# Altium schematic sheet smoothieboard-5driver_3.SchDoc
size 409 x 279 mm; Date: 9/15/2017 15:08:36; Organization: Altium Limited; Address1: L3, 12a Rodborough Rd; Address2: Frenchs Forest; Address3: NSW; Address4: Australia 2086; Origin: Eagle
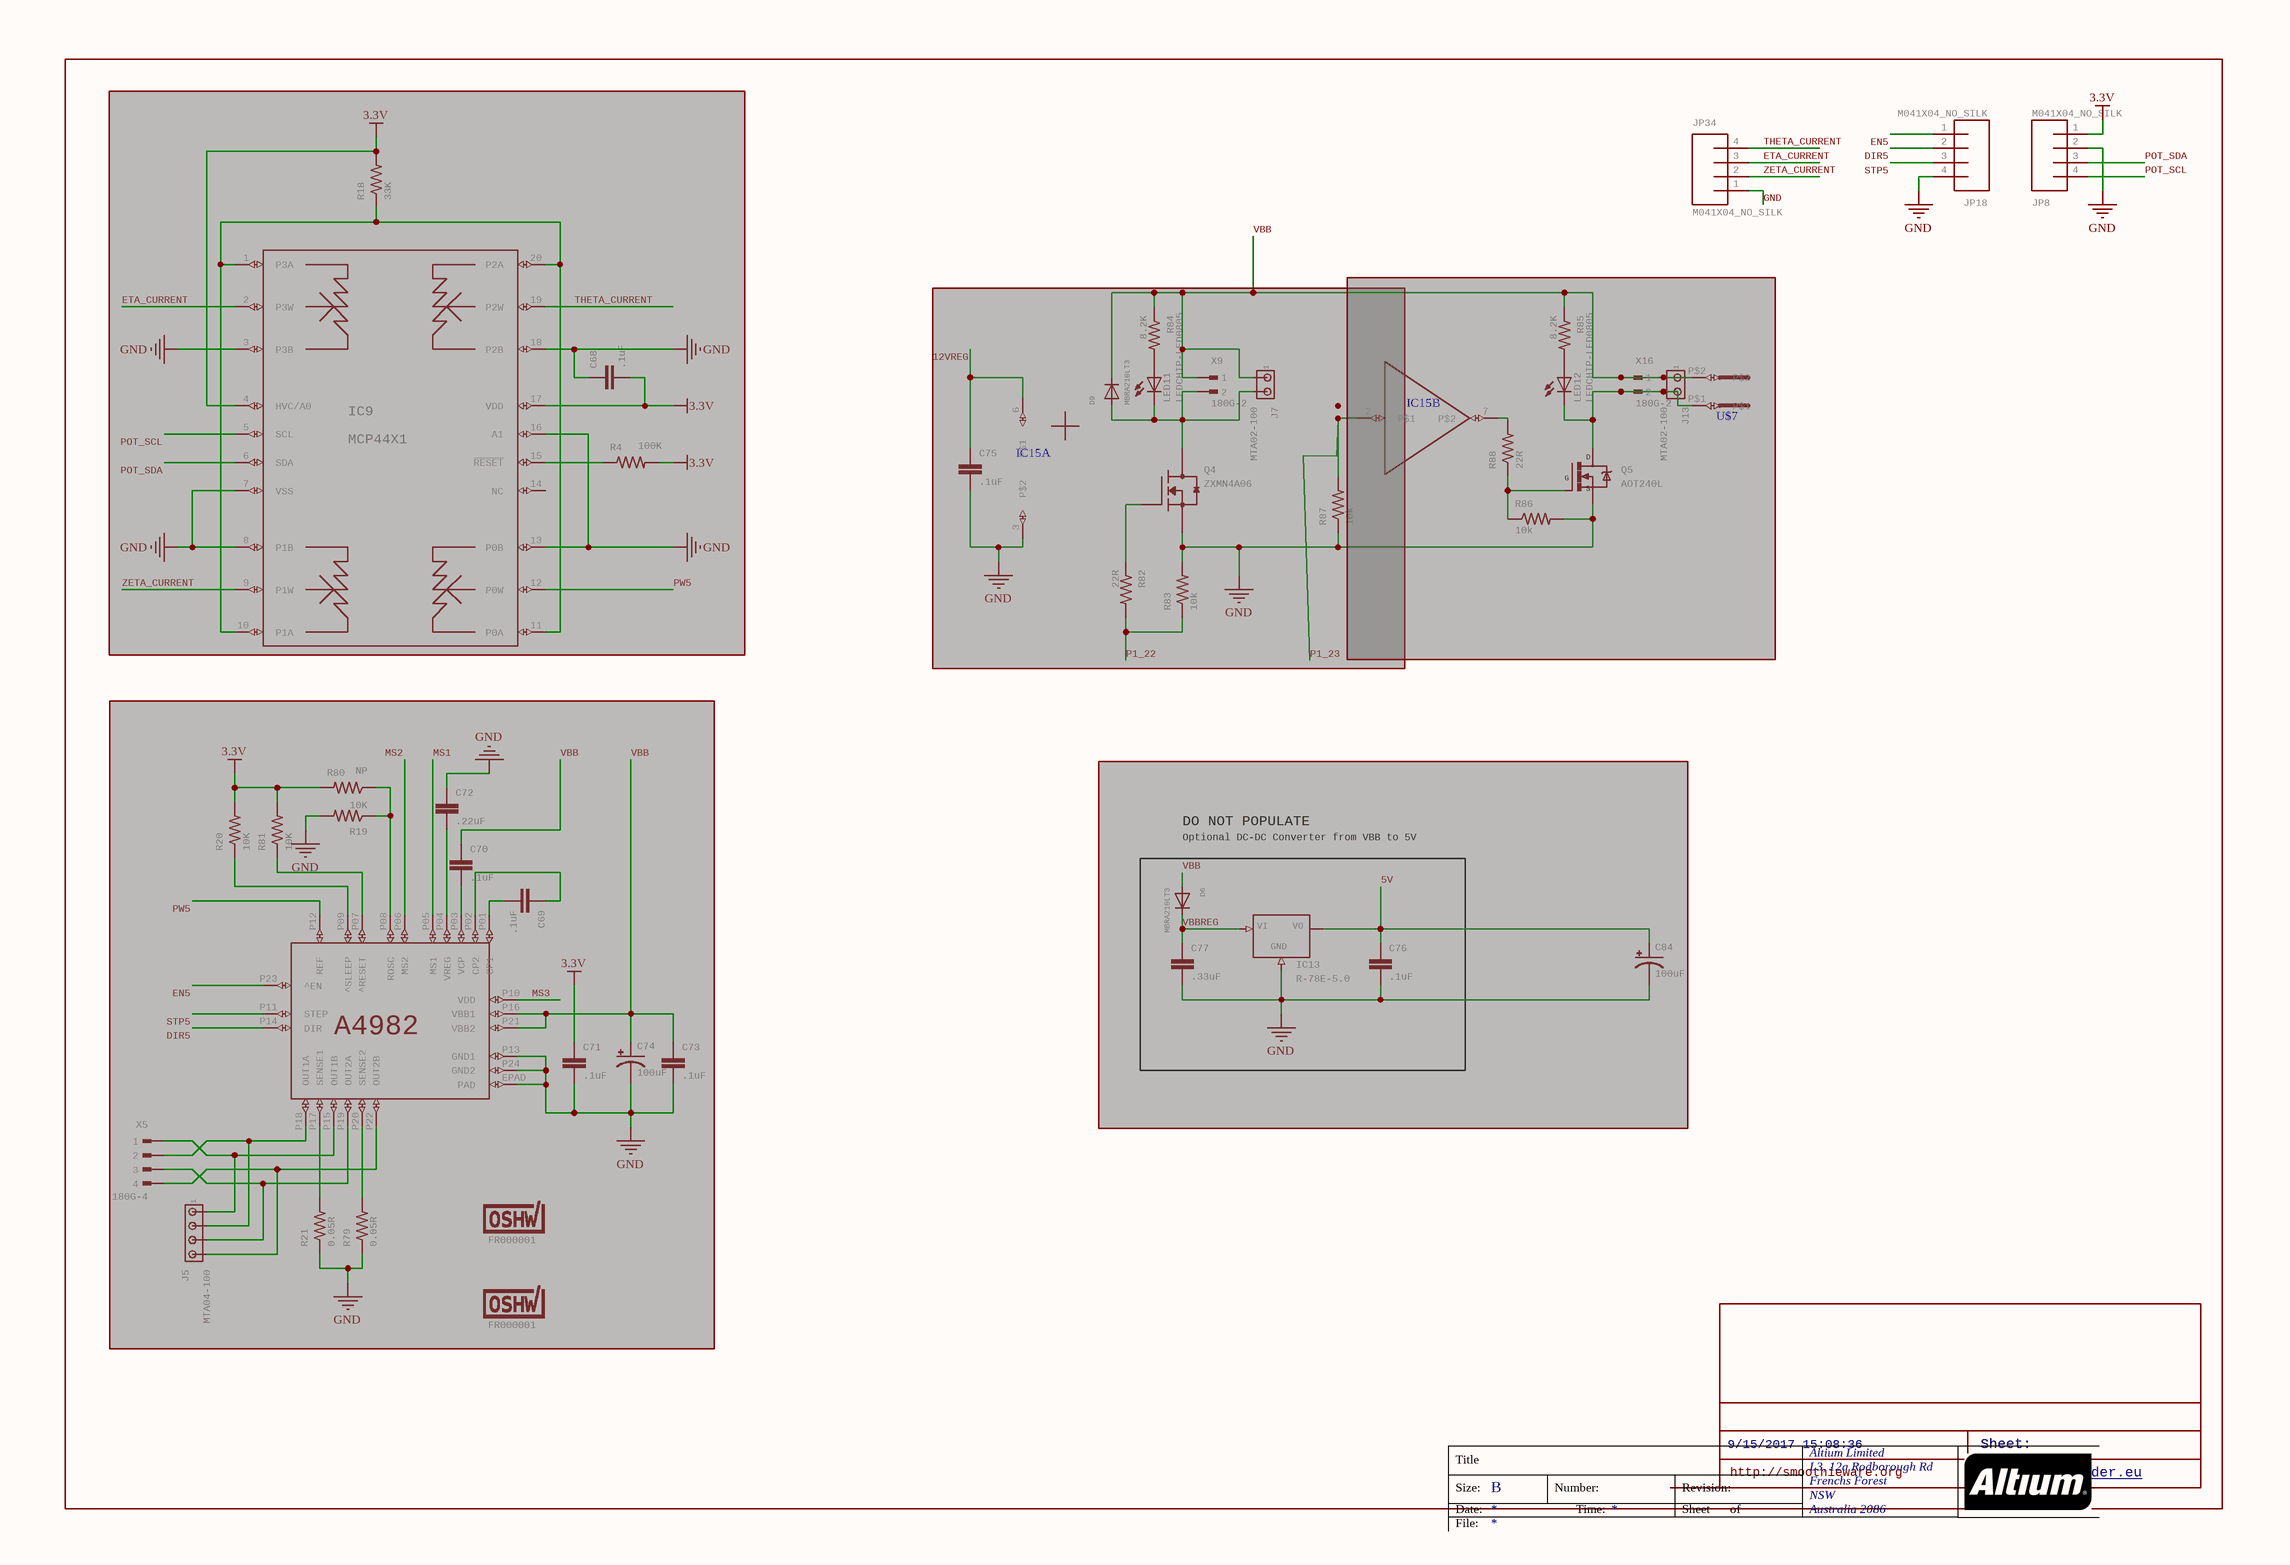
[diagram p0: smoothieboard-5driver_3.SchDoc]

## Parts
C68  .1uF  [C0603]
C69  .1uF  [C0603]
C70  .1uF  [C0603]
C71  .1uF  [C0603]
C72  .22uF  [C0603]
C73  .1uF  [C0603]
C74  100uF  [PANASONIC_E]
C75  .1uF  [C0603]
C76  .1uF  [C0603]
C77  .33uF  [C0603]
C84  100uF  [PANASONIC_D]
D6  MBRA210LT3  [SMADIODE]
D9  MBRA210LT3  [SMADIODE]
IC9  MCP44X1  [TSSOP20]
IC12  A5984  [ETSSOP24]  (value not drawn)
IC13  R-78E-5.0  [R-78]
IC15  TC4427  [SOIC8]  (value not drawn)  (parts A,B of 3)
J5  MTA04-100  [10X04MTA]
J7  MTA02-100  [10X02MTA]
J13  MTA02-100  [10X02MTA]
JP8  M041X04_NO_SILK  [1X04_NO_SILK]
JP18  M041X04_NO_SILK  [1X04_NO_SILK]
JP34  M041X04_NO_SILK  [1X04_NO_SILK]
LED11  LEDCHIP-LED0805  [CHIP-LED0805]
LED12  LEDCHIP-LED0805  [CHIP-LED0805]
Q4  ZXMN4A06  [SOT230P700X160-4N]
Q5  AOT240L  [TO220BV]
R4  100K  [R0603]
R18  33K  [R0603]
R19  10K  [R0603]
R20  10K  [R0603]
R21  0.05R  [R2512]
R79  0.05R  [R2512]
R80  NP  [R0603]
R81  10K  [R0603]
R82  22R  [R0603]
R83  10k  [R0603]
R84  8.2K  [R0603]
R85  8.2K  [R0603]
R86  10k  [R0603]
R87  10k  [R0603]
R88  22R  [R0603]
U$7  5MMCONN  [1715250000]  (value not drawn)
U$11  FR000001  [CERT-SMALL-SILK]
U$12  FR000001  [CERT-MED-SILK]
X5  180G-4  [180G-4]
X9  180G-2  [180G-2]
X16  180G-2  [180G-2]

## Blocks framed on the sheet
DO NOT POPULATE: C84
Optional DC-DC Converter from VBB to 5V: C76 C77 D6 IC13

## Nets
3.3V: C68.2 C71.1 IC9.4(HVC/A0) IC9.17(VDD) JP8.1 R4.2 R18.2 R20.2 R80.2 R81.2
GND: C68.1 C71.2 C72.1 C73.2 C74.- C75.2 C76.2 C77.2 C84.- IC9.3(P3B) IC9.7(VSS) IC9.8(P1B) IC9.13(P0B) IC9.16(A1) IC9.18(P2B) IC12.EPAD(PAD) IC12.P13(GND1) IC12.P24(GND2) IC13.2(GND) IC15.3(P$2) JP8.2 JP18.4 JP34.1 Q4.3(S) Q5.S R19.2 R21.1 R79.1 R83.2 R86.2 R87.1
5V: C76.1 C84.+ IC13.3(VO)
12VREG: C75.1 IC15.6(P$1)
DIR5: IC12.P14(DIR) JP18.2
EN5: IC12.P23(^EN) JP18.1
ETA_CURRENT: IC9.2(P3W) JP34.3
MS1: IC12.P05(MS1)
MS2: IC12.P06(MS2)
MS3: IC12.P10(VDD)
P1_22: R82.2 R83.1
P1_23: IC15.2(P$1) R87.2
POT_SCL: IC9.5(SCL) JP8.4
POT_SDA: IC9.6(SDA) JP8.3
PW5: IC9.12(P0W) IC12.P12(REF)
STP5: IC12.P11(STEP) JP18.3
THETA_CURRENT: IC9.19(P2W) JP34.4
VBB: C70.1 C73.1 C74.+ D6.A D9.C IC12.P16(VBB1) IC12.P21(VBB2) J7.1 J13.1 R84.1 R85.1 U$7.P$2 X9.1 X16.1
VBBREG: C77.1 D6.C IC13.1(VI)
ZETA_CURRENT: IC9.9(P1W) JP34.2
NetC69_1: C69.1 IC12.P02(CP2)
NetC69_2: C69.2 IC12.P01(CP1)
NetC70_2: C70.2 IC12.P03(VCP)
NetC72_2: C72.2 IC12.P04(VREG)
NetD9_A: D9.A J7.2 LED11.C Q4.4(D) X9.2
NetIC9_1: IC9.1(P3A) IC9.10(P1A) IC9.11(P0A) IC9.20(P2A) R18.1
NetIC9_15: IC9.15(~{RESET}) R4.1
NetIC12_P07: IC12.P07(^RESET) R81.1
NetIC12_P08: IC12.P08(ROSC) R19.1 R80.1
NetIC12_P09: IC12.P09(^SLEEP) R20.1
NetIC12_P15: IC12.P15(OUT1B) J5.1 X5.1
NetIC12_P17: IC12.P17(SENSE1) R21.2
NetIC12_P18: IC12.P18(OUT1A) J5.2 X5.2
NetIC12_P19: IC12.P19(OUT2A) J5.3 X5.3
NetIC12_P20: IC12.P20(SENSE2) R79.2
NetIC12_P22: IC12.P22(OUT2B) J5.4 X5.4
NetIC15_7: IC15.7(P$2) R88.2
NetJ13_2: J13.2 LED12.C Q5.D U$7.P$1 X16.2
NetLED11_A: LED11.A R84.2
NetLED12_A: LED12.A R85.2
NetQ4_1: Q4.1(G) R82.1
NetQ5_G: Q5.G R86.1 R88.1

Not connected (* = marked no-connect by the designer): IC9 14(NC)

## Notes on the sheet
- 9/15/2017 15:08:36
- Sheet:
- http://smoothieware.org
- www.microbuilder.eu <http://www.microbuilder.eu>
- Title
- Size:
- Date:
- B
- Number:
- Time:
- Revision:
- Sheet
- of
- File:

## Library data of the parts
C68-C73 C75-C77 = C-EUC0603: CAPACITOR, European symbol; GateName_1: G$1; SymbolName_1: C-EU; DeviceName: C0603; DeviceSetName: C-EU
  C68-C73 C76 C77: LibraryName: rcl
  C75: LibraryName: resistor
C74 = CAP_POLE: Capacitor PolarizedThese are standard SMD and PTH capacitors. Normally 10uF, 47uF, and 100uF in electrolytic and tantalum varieties. Always verify the external diameter of the through hole cap, it varies with capacity, voltage, and manufacturer. The EIA devices should be standard.; GateName_1: G$1; DeviceName: E; SymbolName_1: CAP_POL; LibraryName: SparkFun; DeviceSetName: CAP_POL
C84 = CAP_POLD: Capacitor PolarizedThese are standard SMD and PTH capacitors. Normally 10uF, 47uF, and 100uF in electrolytic and tantalum varieties. Always verify the external diameter of the through hole cap, it varies with capacity, voltage, and manufacturer. The EIA devices should be standard.; GateName_1: G$1; DeviceName: D; SymbolName_1: CAP_POL; LibraryName: SparkFun-Capacitors; DeviceSetName: CAP_POL
D6 D9 = DIODESMA: Diode   SMADIODE - SMA Surface Mount Package  20V 1A Schottky Diode Digikey (500mV @ 1A, 500uA Vr @ 20V): 641-1014-6-ND  10V 2A Schottky Diode Digikey (350mV @ 2A, 700uA Vr @ 10V): MBRA210LT3    SOD-123 30V 200mA (800mV Vf, 2uA Vr @ 25V) Schottky Diode (very fast switching for boost, etc.) - Digikey: BAT54T1GOSTR-ND  30V 500mA (430mV Vf, 130uA Vr @ 30V) Schottky Diode - Digikey: B0530W-FDICT-ND  MBR120 1A 20V (0.34Vf) Schottky Diode - Digikey: MBR120VLSFT1GOSCT-ND    SOD-323 10V 570mA (380mV Vf, 3ns) Schottky Diode - Digikey: ZLLS410CT-ND  1N4148WS - 75V 150mA (1V Vf @ 10mA, 4ns) Simple Diode - Digikey: 1N4148WSFSCT-ND, Mouser: 512-1N4148WS    SOD-523 BAT54 30V 200mA Schottky (0.8 Vf @ 100mA, 5ns) - Digikey: BAT54XV2CT-ND  30V 30mA Schottky Diode (RB751S-40TE61) - Digikey: RB751S-40TE61CT-ND    SOT23-R/W - SOT23 Package (R = Solder Paste/Reflow Ovens, W = Hand-Soldering)  BAT54Film 40V 300mA - Digikey: 497-7162-1-ND    DO-1N4148 Through Hole Small Current Diode (any model); GateName_1: G$1; SymbolName_1: DIODE; DeviceName: SMA; LibraryName: microbuilder; DeviceSetName: DIODE
IC9 = MCP44X1: MCP44x1    MCP4451 -  ? Quad Resistor Network ? I2C Serial Interface Support ? Potentiometer or Rheostat Configuration Options ? Resistor Network Resolution: 7-bit ? 128 Resistors (129 Taps) 8-bit ? 256 Resistors (257 Taps); GateName_1: G$1; SymbolName_1: MCP44X1; LibraryName: Geos; DeviceSetName: MCP44X1
IC12 = A4982: GateName_1: G$1; SymbolName_1: A4982; LibraryName: A4982; DeviceSetName: A4982; A4982: A4982
IC13 = R-78: GateName_1: G$1; SymbolName_1: R-78; LibraryName: logxen; DeviceSetName: R-78; GND: GND; VI: VI; VO: VO
IC15 = TC4427: GateName_1: RAILS; GateName_2: A; SymbolName_2: BUFFER; GateName_3: B; SymbolName_1: RAILS; SymbolName_3: BUFFER; LibraryName: custom_esorensen; DeviceSetName: TC4427
J5 = MTA04-100: AMP connector; GateName_1: G$1; SymbolName_1: MTA-1_4; LibraryName: con-amp; DeviceSetName: MTA04-100; 1: 1
J7 J13 = MTA02-100: AMP connector; GateName_1: G$1; SymbolName_1: MTA-1_2; LibraryName: con-amp; DeviceSetName: MTA02-100; 1: 1
JP8 JP18 JP34 = M041X04_NO_SILK: Header 4Standard 4-pin 0.1" header. Use with straight break away headers (SKU : PRT-00116), right angle break away headers (PRT-00553), swiss pins (PRT-00743), machine pins (PRT-00117), and female headers (PRT-00115). Molex polarized connector foot print use with SKU : PRT-08231 with associated crimp pins and housings. 1MM SMD Version SKU: PRT-10208; GateName_1: G$1; SymbolName_1: M04; DeviceName: 1X04_NO_SILK; LibraryName: SparkFun; DeviceSetName: M04
LED11 LED12 = LEDCHIP-LED0805: LED   OSRAM: - CHIPLED LG R971, LG N971, LY N971, LG Q971, LY Q971, LO R971, LY R971 LH N974, LH R974 LS Q976, LO Q976, LY Q976 LO Q996 - Hyper CHIPLED LW Q18S LB Q993, LB Q99A, LB R99A - SideLED LS A670, LO A670, LY A670, LG A670, LP A670 LB A673, LV A673, LT A673, LW A673 LH A674 LY A675 LS A676, LA A676, LO A676, LY A676, LW A676 LS A679, LY A679, LG A679 -  Hyper Micro SIDELEDÂ® LS Y876, LA Y876, LO Y876, LY Y876 LT Y87S - SmartLED LW L88C, LW L88S LB L89C, LB L89S, LG L890 LS L89K, LO L89K, LY L89K LS L896, LA L896, LO L896, LY L896 - TOPLED LS T670, LO T670, LY T670, LG T670, LP T670 LSG T670, LSP T670, LSY T670, LOP T670, LYG T670 LG T671, LOG T671, LSG T671 LB T673, LV T673, LT T673, LW T673 LH T674 LS T676, LA T676, LO T676, LY T676, LB T676, LH T676, LSB T676, LW T676 LB T67C, LV T67C, LT T67C, LS T67K, LO T67K, LY T67K, LW E67C LS E67B, LA E67B, LO E67B, LY E67B, LB E67C, LV E67C, LT E67C LW T67C LS T679, LY T679, LG T679 LS T770, LO T770, LY T770, LG T770, LP T770 LB T773, LV T773, LT T773, LW T773 LH T774 LS E675, LA E675, LY E675, LS T675 LS T776, LA T776, LO T776, LY T776, LB T776 LHGB T686 LT T68C, LB T68C - Hyper Mini TOPLEDÂ® LB M676 - Mini TOPLED SantanaÂ® LG M470 LS M47K, LO M47K, LY M47K    Source: http://www.osram.convergy.de   LUXEON: - LUMILEDÂ® LXK2-PW12-R00, LXK2-PW12-S00, LXK2-PW14-U00, LXK2-PW14-V00 LXK2-PM12-R00, LXK2-PM12-S00, LXK2-PM14-U00 LXK2-PE12-Q00, LXK2-PE12-R00, LXK2-PE12-S00, LXK2-PE14-T00, LXK2-PE14-U00 LXK2-PB12-K00, LXK2-PB12-L00, LXK2-PB12-M00, LXK2-PB14-N00, LXK2-PB14-P00, LXK2-PB14-Q00 LXK2-PR12-L00, LXK2-PR12-M00, LXK2-PR14-Q00, LXK2-PR14-R00 LXK2-PD12-Q00, LXK2-PD12-R00, LXK2-PD12-S00 LXK2-PH12-R00, LXK2-PH12-S00 LXK2-PL12-P00, LXK2-PL12-Q00, LXK2-PL12-R00    Source: www.luxeon.com   KINGBRIGHT:   KA-3528ASYC Source: www.kingbright.com; GateName_1: G$1; SymbolName_1: LED; DeviceName: CHIP-LED0805; LibraryName: led; DeviceSetName: LED
Q4 = MOSFET-NCH_SOT-223: GateName_1: G$1; SymbolName_1: MOSFET-NCH; DeviceName: SOT-223; LibraryName: ipc-7351-transistor; DeviceSetName: MOSFET-NCH_
Q5 = IRF540: HEXFET Power MOSFET; GateName_1: G$1; SymbolName_1: MFNS; LibraryName: transistor-power; DeviceSetName: IRF540; D: D; S: S; G: G
R4 R18-R20 R80-R88 = R-US_R0603: RESISTOR, American symbol; GateName_1: G$1; SymbolName_1: R-US; DeviceSetName: R-US_; DeviceName: R0603; LibraryName: resistor
R21 R79 = RESISTOR2512: ResistorBasic schematic elements and footprints for 0603, 1206, and PTH 1/10th watt (small) resistors.; GateName_1: G$1; DeviceName: 2512; SymbolName_1: RESISTOR; LibraryName: SparkFun; DeviceSetName: RESISTOR
U$7 = 5MMCONN: GateName_1: G$1; SymbolName_1: JUMPER; LibraryName: eric_sorensen; DeviceSetName: 5MMCONN
U$11 = CERT-SMALL: GateName_1: G$1; SymbolName_1: CERT; DeviceName: -SMALL; LibraryName: OSHWA; DeviceSetName: CERT
U$12 = CERT-MEDIUM: GateName_1: G$1; SymbolName_1: CERT; DeviceName: -MEDIUM; LibraryName: OSHWA; DeviceSetName: CERT
X5 = 180G-4: WEIDMUELLER CLAMP CONNECTOR; GateName_1: G$1; SymbolName_1: MALE-4; LibraryName: con-weidmueller-sl35; DeviceSetName: 180G-4; MF: MF; MPN: MPN; OC_FARNELL: unknown; OC_NEWARK: unknown
X9 X16 = 180G-2: WEIDMUELLER CLAMP CONNECTOR; GateName_1: G$1; SymbolName_1: MALE-2; LibraryName: con-weidmueller-sl35; DeviceSetName: 180G-2; MF: MF; MPN: MPN; OC_FARNELL: unknown; OC_NEWARK: unknown